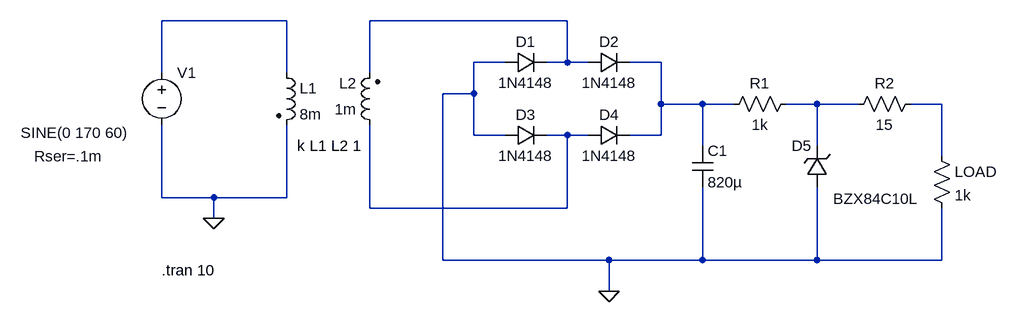
[diagram p0: schematic rectifier.asc]
rectifier.asc, the LTspice schematic file:
Version 4
SHEET 1 1016 680
WIRE -224 64 -416 64
WIRE 208 64 -96 64
WIRE 112 128 64 128
WIRE 208 128 208 64
WIRE 208 128 176 128
WIRE 240 128 208 128
WIRE 352 128 304 128
WIRE -416 144 -416 64
WIRE -224 144 -224 64
WIRE -96 144 -96 64
WIRE 64 176 64 128
WIRE 64 176 16 176
WIRE 352 192 352 128
WIRE 416 192 352 192
WIRE 464 192 416 192
WIRE 592 192 544 192
WIRE 656 192 592 192
WIRE 784 192 736 192
WIRE 64 240 64 176
WIRE 112 240 64 240
WIRE 208 240 176 240
WIRE 240 240 208 240
WIRE 352 240 352 192
WIRE 352 240 304 240
WIRE 416 256 416 192
WIRE 592 256 592 192
WIRE 784 272 784 192
WIRE -416 336 -416 224
WIRE -336 336 -416 336
WIRE -224 336 -224 224
WIRE -224 336 -336 336
WIRE -96 352 -96 224
WIRE 208 352 208 240
WIRE 208 352 -96 352
WIRE -336 368 -336 336
WIRE 16 432 16 176
WIRE 272 432 16 432
WIRE 416 432 416 320
WIRE 416 432 272 432
WIRE 592 432 592 320
WIRE 592 432 416 432
WIRE 784 432 784 352
WIRE 784 432 592 432
WIRE 272 480 272 432
FLAG 272 480 0
FLAG -336 368 0
SYMBOL diode 112 144 R270
WINDOW 0 32 32 VTop 2
WINDOW 3 0 32 VBottom 2
SYMATTR InstName D1
SYMATTR Value 1N4148
SYMBOL diode 240 144 R270
WINDOW 0 32 32 VTop 2
WINDOW 3 0 32 VBottom 2
SYMATTR InstName D2
SYMATTR Value 1N4148
SYMBOL diode 112 256 R270
WINDOW 0 32 32 VTop 2
WINDOW 3 0 32 VBottom 2
SYMATTR InstName D3
SYMATTR Value 1N4148
SYMBOL diode 240 256 R270
WINDOW 0 32 32 VTop 2
WINDOW 3 0 32 VBottom 2
SYMATTR InstName D4
SYMATTR Value 1N4148
SYMBOL ind2 -240 128 R0
SYMATTR InstName L1
SYMATTR Value 8m
SYMATTR Type ind
SYMBOL ind2 -80 240 R180
WINDOW 0 36 80 Left 2
WINDOW 3 36 40 Left 2
SYMATTR InstName L2
SYMATTR Value 1m
SYMATTR Type ind
SYMBOL voltage -416 128 R0
WINDOW 123 0 0 Left 0
WINDOW 39 -196 144 Left 2
WINDOW 3 -217 108 Left 2
SYMATTR SpiceLine Rser=.1m
SYMATTR InstName V1
SYMATTR Value SINE(0 170 60)
SYMBOL cap 400 256 R0
SYMATTR InstName C1
SYMATTR Value 820µ
SYMBOL zener 608 320 R180
WINDOW 0 24 64 Left 2
WINDOW 3 -140 -18 Left 2
SYMATTR InstName D5
SYMATTR Value BZX84C10L
SYMBOL res 768 256 R0
SYMATTR InstName LOAD
SYMATTR Value 1k
SYMBOL res 560 176 R90
WINDOW 0 0 56 VBottom 2
WINDOW 3 32 56 VTop 2
SYMATTR InstName R1
SYMATTR Value 1k
SYMBOL res 752 176 R90
WINDOW 0 0 56 VBottom 2
WINDOW 3 32 56 VTop 2
SYMATTR InstName R2
SYMATTR Value 15
TEXT -208 256 Left 2 !k L1 L2 1
TEXT -416 448 Left 2 !.tran 10

The netlist it stands for:
* rectifier.asc
D1 0 N002 1N4148
D2 N002 N003 1N4148
D3 0 N006 1N4148
D4 N006 N003 1N4148
L1 N001 0 8m
L2 N006 N002 1m
V1 N001 0 SINE(0 170 60) Rser=.1m
C1 N003 0 820µ
D5 0 N004 BZX84C10L
R§LOAD N005 0 1k
R1 N004 N003 1k
R2 N005 N004 15
.model D D
.lib standard.dio
k L1 L2 1
.tran 10
.backanno
.end